# Altium project MAGI'sCore.PrjPCB
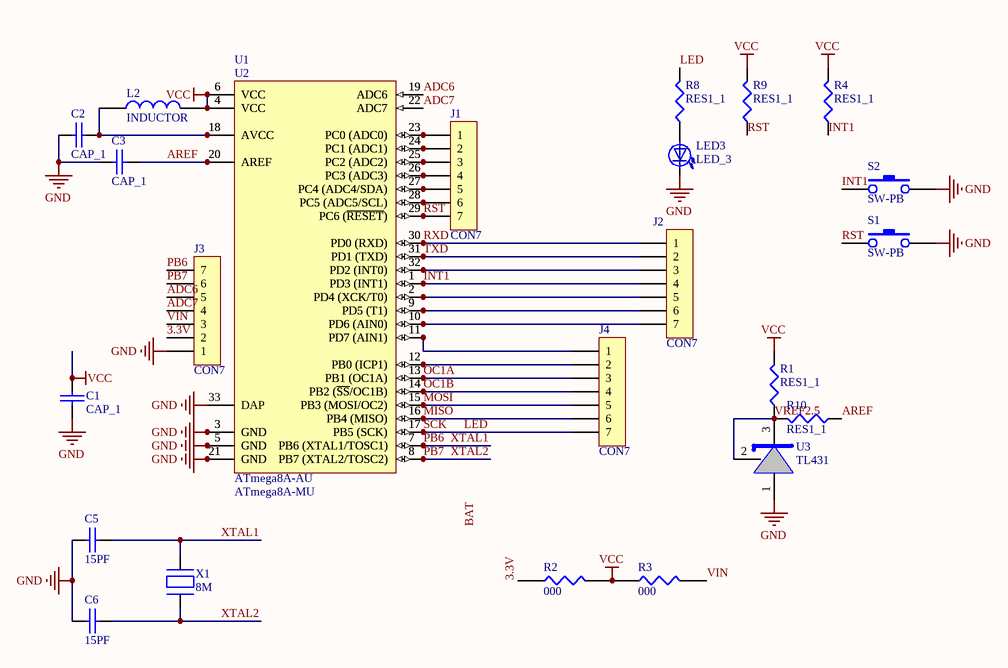
[diagram p0: MAGI'sCore.SchDoc]
1 sheet, 24 parts. Net scope: global (net labels, ports and power ports of the same name join across sheets).
Board file: MAGI'sCore.PcbDoc

## Sheet MAGI'sCore.SchDoc
size A4

### Parts
C1  CAP_1  [1210]
C2  CAP_1  [6-0805_N]
C3  CAP_1  [6-0805_N]
C5  15PF  [6-0805_n]
C6  15PF  [6-0805_n]
J1  CON7  [CON7]
J2  CON7  [CON7]
J3  CON7  [CON7]
J4  CON7  [CON7]
L2  INDUCTOR  [14-1210]
LED3  LED_3  [6-0805_N]
R1  RES1_1  [6-0805_N]
R2  000  [6-0805_n]
R3  000  [6-0805_n]
R4  RES1_1  [6-0805_N]
R8  RES1_1  [6-0805_N]
R9  RES1_1  [6-0805_N]
R10  RES1_1  [6-0805_N]
S1  SW-PB  [SKRELGE010]
S2  SW-PB  [SKRELGE010]
U1  ATmega8A-AU  [32A_N]
U2  ATmega8A-MU  [32M1-A_N]
U3  TL431  [SOT23_N]
X1  8M  [5032]

### Nets
GND: C1.1 C2.1 C3.1 C5.1 C6.1 J3.1 LED3.2(K) S1.2 S2.2 U1.3(GND) U1.5(GND) U1.21(GND) U2.3(GND) U2.5(GND) U2.21(GND) U2.33(DAP) U3.1(CATHODE)
VCC: C1.2 L2.2 R1.2 R2.2 R3.1 R4.2 R9.2 U1.4(VCC) U1.6(VCC) U2.4(VCC) U2.6(VCC)
3.3V: J3.2 R2.1
ADC6: J3.5 U1.19(ADC6) U2.19(ADC6)
ADC7: J3.4 U1.22(ADC7) U2.22(ADC7)
AREF: C3.2 R10.1 U1.20(AREF) U2.20(AREF)
INT1: J2.4 R4.1 S2.1 U1.1(PD3_(INT1)) U2.1(PD3_(INT1))
LED: J4.7 R8.2 U1.17(PB5_(SCK)) U2.17(PB5_(SCK))  [also labelled SCK]
MISO: J4.6 U1.16(PB4_(MISO)) U2.16(PB4_(MISO))
MOSI: J4.5 U1.15(PB3_(MOSI/OC2)) U2.15(PB3_(MOSI/OC2))
OC1A: J4.3 U1.13(PB1_(OC1A)) U2.13(PB1_(OC1A))
OC1B: J4.4 U1.14(PB2_(~{SS}/OC1B)) U2.14(PB2_(~{SS}/OC1B))
PB6: C5.2 J3.7 U1.7(PB6_(XTAL1/TOSC1)) U2.7(PB6_(XTAL1/TOSC1)) X1.1  [also labelled XTAL1]
PB7: C6.2 J3.6 U1.8(PB7_(XTAL2/TOSC2)) U2.8(PB7_(XTAL2/TOSC2)) X1.2  [also labelled XTAL2]
RST: J1.7 R9.1 S1.1 U1.29(PC6_(~{RESET})) U2.29(PC6_(~{RESET}))
RXD: J2.1 U1.30(PD0_(RXD)) U2.30(PD0_(RXD))
TXD: J2.2 U1.31(PD1_(TXD)) U2.31(PD1_(TXD))
VIN: J3.3 R3.2
VREF2.5: R1.1 R10.2 U3.2(REF) U3.3(ANODE)
NetC2_2: C2.2 L2.1 U1.18(AVCC) U2.18(AVCC)
NetJ1_1: J1.1 U1.23(PC0_(ADC0)) U2.23(PC0_(ADC0))
NetJ1_2: J1.2 U1.24(PC1_(ADC1)) U2.24(PC1_(ADC1))
NetJ1_3: J1.3 U1.25(PC2_(ADC2)) U2.25(PC2_(ADC2))
NetJ1_4: J1.4 U1.26(PC3_(ADC3)) U2.26(PC3_(ADC3))
NetJ1_5: J1.5 U1.27(PC4_(ADC4/SDA)) U2.27(PC4_(ADC4/SDA))
NetJ1_6: J1.6 U1.28(PC5_(ADC5/SCL)) U2.28(PC5_(ADC5/SCL))
NetJ2_3: J2.3 U1.32(PD2_(INT0)) U2.32(PD2_(INT0))
NetJ2_5: J2.5 U1.2(PD4_(XCK/T0)) U2.2(PD4_(XCK/T0))
NetJ2_6: J2.6 U1.9(PD5_(T1)) U2.9(PD5_(T1))
NetJ2_7: J2.7 U1.10(PD6_(AIN0)) U2.10(PD6_(AIN0))
NetJ4_1: J4.1 U1.11(PD7_(AIN1)) U2.11(PD7_(AIN1))
NetJ4_2: J4.2 U1.12(PB0_(ICP1)) U2.12(PB0_(ICP1))
NetLED3_1: LED3.1(A) R8.1

### Notes on the sheet
- Labels drawn without touching a wire or pin: BAT

### Library data of the parts
C1-C3 = CAP_1: Capacitor
C5 C6 = CAP
J1-J4 = CON7: Connector
R2 R3 = RES1
U1 = ATmega8A-AU: 8-bit AVR Microcontroller, 8KB Flash, 512 Bytes EEPROM, 1KB SRAM, 32-pin TQFP, Industrial Grade (-40癈 to 85癈); Published: 1-Apr-2010; DatasheetVersion: revC, Jul-2009; PackageVersion: revB, Oct-2001; PackageReference: 32A; Publisher: Altium Limited; PackageDescription: 32-Lead, 7x7x1.0 mm Body, 0.8mm Lead Pitch, Thin Profile Plastic Quad Flat Package (TQFP); Supplier 1: Digi-Key; Supplier Part Number 1: ATMEGA8A-AU-ND; Supplier 2: Farnell; Supplier Part Number 2: 1748532; Supplier 3: Mouser; Supplier Part Number 3: 556-ATMEGA8A-AU; Code_JEDEC: MS-026-ABA; ComponentLink1Description: Manufacturer Link; ComponentLink1URL: http://www.atmel.com/products/avr/default.asp?; ComponentLink2Description: ATmega8A Datasheet; ComponentLink2URL: http://www.atmel.com/dyn/resources/prod_documents/doc8159.pdf; ComponentLink3Description: ATmega8A Summary; ComponentLink3URL: http://www.atmel.com/dyn/resources/prod_documents/8159S.pdf; ComponentLink4Description: Atmel.com Home; ComponentLink4URL: http://www.atmel.com
U2 = ATmega8A-MU: 8-bit AVR Microcontroller, 8KB Flash, 512 Bytes EEPROM, 1KB SRAM, 33-pin MLF, Industrial Grade (-40癈 to 85癈); Published: 1-Apr-2010; DatasheetVersion: revC, Jul-2009; PackageVersion: revE, May-2006; PackageReference: 32M1-A; Publisher: Altium Limited; PackageDescription: 32-Pin Micro Lead Frame Package (MLF),  5 x 5 x 1.0 mm Body, Pitch 0.50 mm, 3.10mm Exposed Pad; Supplier 1: Digi-Key; Supplier Part Number 1: ATMEGA8A-MU-ND; Supplier 2: Farnell; Supplier Part Number 2: 1748533; Supplier 3: Mouser; Supplier Part Number 3: 556-ATMEGA8A-MU; Code_JEDEC: MO-220-VHHD-2; ComponentLink1Description: Manufacturer Link; ComponentLink1URL: http://www.atmel.com/products/avr/default.asp?; ComponentLink2Description: ATmega8A Datasheet; ComponentLink2URL: http://www.atmel.com/dyn/resources/prod_documents/doc8159.pdf; ComponentLink3Description: ATmega8A Summary; ComponentLink3URL: http://www.atmel.com/dyn/resources/prod_documents/8159S.pdf; ComponentLink4Description: Atmel.com Home; ComponentLink4URL: http://www.atmel.com
X1 = CRYSTAL